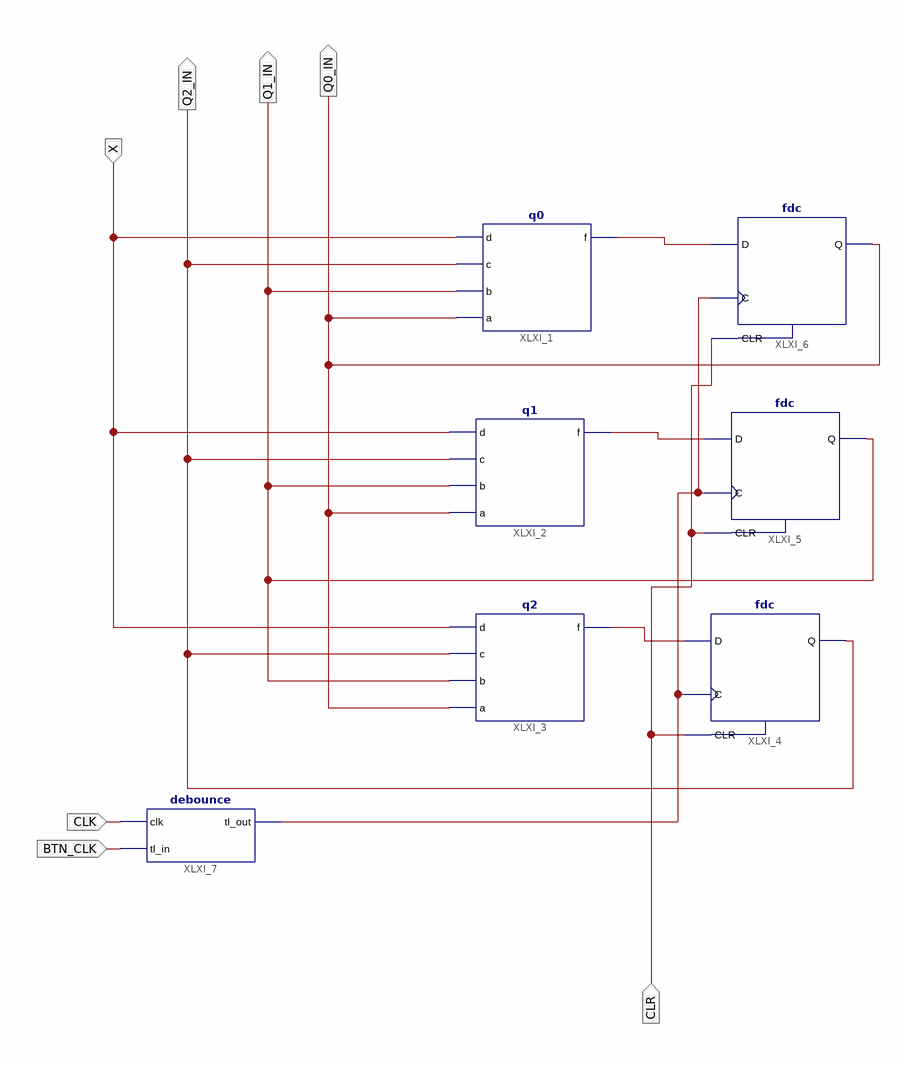
[diagram p0: schematic sheet 1]
// Xilinx ISE schematic result.sch (spartan3e) as structural Verilog: 7 symbols, 7 ports
module result (
  input  CLR,
  input  CLK,
  input  BTN_CLK,
  input  X,
  output Q0_IN,
  output Q1_IN,
  output Q2_IN
);

  wire XLXN_1, XLXN_2, XLXN_3, XLXN_7;

  q0 XLXI_1 (.d(X), .c(Q2_IN), .b(Q1_IN), .a(Q0_IN), .f(XLXN_1));
  q1 XLXI_2 (.d(X), .c(Q2_IN), .b(Q1_IN), .a(Q0_IN), .f(XLXN_2));
  q2 XLXI_3 (.d(X), .c(Q2_IN), .b(Q1_IN), .a(Q0_IN), .f(XLXN_3));
  fdc XLXI_4 (.C(XLXN_7), .CLR(CLR), .D(XLXN_3), .Q(Q2_IN));
  fdc XLXI_5 (.C(XLXN_7), .CLR(CLR), .D(XLXN_2), .Q(Q1_IN));
  fdc XLXI_6 (.C(XLXN_7), .CLR(CLR), .D(XLXN_1), .Q(Q0_IN));
  debounce XLXI_7 (.clk(CLK), .tl_in(BTN_CLK), .tl_out(XLXN_7));
endmodule
